# Altium schematic sheet Ethernet.SchDoc
size A4; Author: JCD
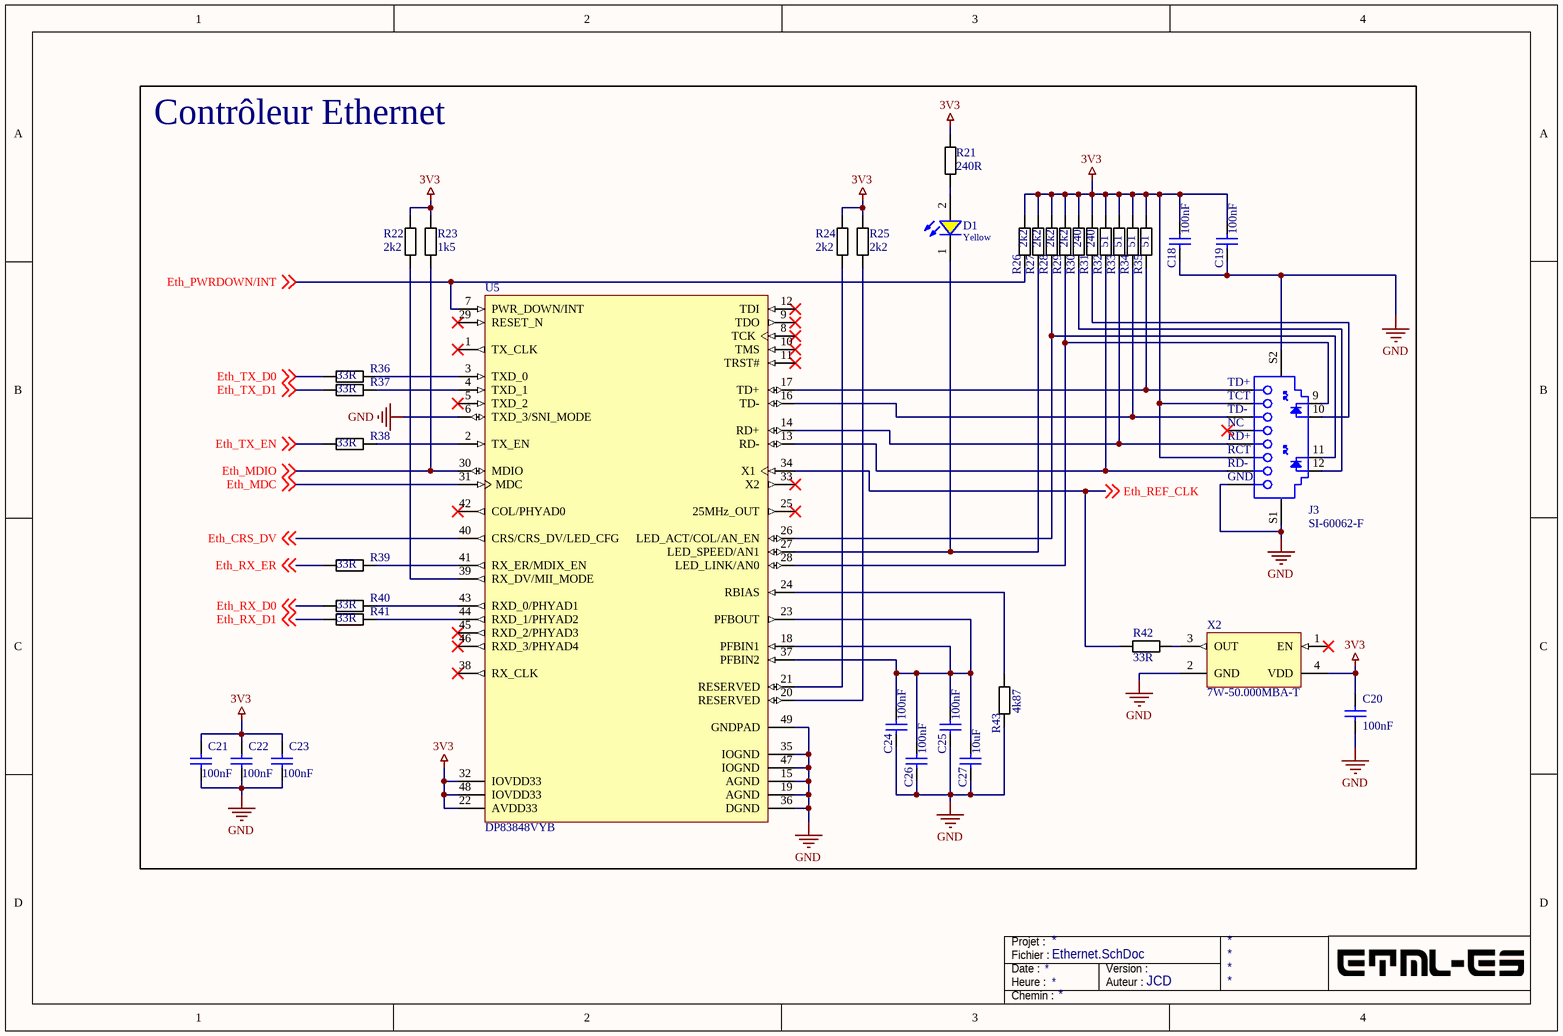
[diagram p0: Ethernet.SchDoc]

## Parts
C18  100nF  [C0805]
C19  100nF  [C0805]
C20  100nF  [C0805]
C21  100nF  [C0805]
C22  100nF  [C0805]
C23  100nF  [C0805]
C24  100nF  [C0805]
C25  100nF  [C0805]
C26  100nF  [C0805]
C27  10uF  [C0805]
D1  Yellow  [WL-SMCW_0805]
J3  SI-60062-F  [BELF-SI-60062-F_V]
R21  240R  [RESC0805(2012)_L]
R22  2k2  [RESC0805(2012)_L]
R23  1k5  [RESC0805(2012)_L]
R24  2k2  [RESC0805(2012)_L]
R25  2k2  [RESC0805(2012)_L]
R26  2k2  [RESC0805(2012)_L]
R27  2k2  [RESC0805(2012)_L]
R28  2k2  [RESC0805(2012)_L]
R29  2k2  [RESC0805(2012)_L]
R30  240  [RESC0805(2012)_L]
R31  240  [RESC0805(2012)_L]
R32  51  [RESC0805(2012)_L]
R33  51  [RESC0805(2012)_L]
R34  51  [RESC0805(2012)_L]
R35  51  [RESC0805(2012)_L]
R36  33R  [RESC0805(2012)_L]
R37  33R  [RESC0805(2012)_L]
R38  33R  [RESC0805(2012)_L]
R39  33R  [RESC0805(2012)_L]
R40  33R  [RESC0805(2012)_L]
R41  33R  [RESC0805(2012)_L]
R42  33R  [RESC0805(2012)_L]
R43  4k87  [RESC0805(2012)_L]
U5  DP83848VYB  [DP83848]
X2  7W-50.000MBA-T  [TXC-L500W700H130-4_V]

## Blocks framed on the sheet
Contrôleur Ethernet: C18-C27 D1 J3 R21-R43 U5 X2

## Nets
3V3: C18.2 C19.2 C20.2 C21.2 C22.2 C23.2 J3.2(TCT) J3.6(RCT) R21.1 R22.1 R23.1 R24.1 R25.1 R26.1 R27.1 R28.1 R29.1 R30.1 R31.1 R32.1 R33.1 R34.1 R35.1 U5.22(AVDD33) U5.32(IOVDD33) U5.48(IOVDD33) X2.4(VDD)
GND: C18.1 C19.1 C20.1 C21.1 C22.1 C23.1 C24.1 C25.1 C26.1 C27.1 J3.8(GND) J3.S1 J3.S2 R43.2 U5.6(TXD_3/SNI_MODE) U5.15(AGND) U5.19(AGND) U5.35(IOGND) U5.36(DGND) U5.47(IOGND) U5.49(GNDPAD) X2.2(GND)
Eth_CRS_DV: U5.40(CRS/CRS_DV/LED_CFG) ; off-sheet Eth_CRS_DV
Eth_MDC: U5.31(MDC) ; off-sheet Eth_MDC
Eth_MDIO: R23.2 U5.30(MDIO) ; off-sheet Eth_MDIO
Eth_PWRDOWN/INT: R26.2 U5.7(PWR_DOWN/INT) ; off-sheet Eth_PWRDOWN/INT
Eth_REF_CLK: R42.1 U5.34(X1) ; off-sheet Eth_REF_CLK
Eth_RX_D0: R40.1 ; off-sheet Eth_RX_D0
Eth_RX_D1: R41.1 ; off-sheet Eth_RX_D1
Eth_RX_ER: R39.1 ; off-sheet Eth_RX_ER
Eth_TX_D0: R36.1 ; off-sheet Eth_TX_D0
Eth_TX_D1: R37.1 ; off-sheet Eth_TX_D1
Eth_TX_EN: R38.1 ; off-sheet Eth_TX_EN
NetC24_2: C24.2 C25.2 C26.2 C27.2 U5.18(PFBIN1) U5.23(PFBOUT) U5.37(PFBIN2)
NetD1_1: D1.1(K) R27.2 U5.27(LED_SPEED/AN1)
NetD1_2: D1.2(A) R21.2
NetJ3_1: J3.1(TD+) R35.2 U5.17(TD+)
NetJ3_3: J3.3(TD-) R34.2 U5.16(TD-)
NetJ3_5: J3.5(RD+) R33.2 U5.14(RD+)
NetJ3_7: J3.7(RD-) R32.2 U5.13(RD-)
NetJ3_9: J3.9 R29.2 U5.28(LED_LINK/AN0)
NetJ3_10: J3.10 R31.2
NetJ3_11: J3.11 R28.2 U5.26(LED_ACT/COL/AN_EN)
NetJ3_12: J3.12 R30.2
NetR22_2: R22.2 U5.39(RX_DV/MII_MODE)
NetR24_2: R24.2 U5.21(RESERVED)
NetR25_2: R25.2 U5.20(RESERVED)
NetR36_2: R36.2 U5.3(TXD_0)
NetR37_2: R37.2 U5.4(TXD_1)
NetR38_2: R38.2 U5.2(TX_EN)
NetR39_2: R39.2 U5.41(RX_ER/MDIX_EN)
NetR40_2: R40.2 U5.43(RXD_0/PHYAD1)
NetR41_2: R41.2 U5.44(RXD_1/PHYAD2)
NetR42_2: R42.2 X2.3(OUT)
NetR43_1: R43.1 U5.24(RBIAS)

Not connected (* = marked no-connect by the designer): J3 4(NC)*; U5 1(TX_CLK)* 5(TXD_2)* 8(TCK)* 9(TDO)* 10(TMS)* 11(TRST#)* 12(TDI)* 25(25MHz_OUT)* 29(RESET_N)* 33(X2)* 38(RX_CLK)* 42(COL/PHYAD0)* 45(RXD_2/PHYAD3)* 46(RXD_3/PHYAD4)*; X2 1(EN)*

## Notes on the sheet
- Fichier :
- Date :
- Heure :
- Projet :
- Auteur :
- Version :
- Chemin :

## Library data of the parts
C18-C27 = Cap: Capacitor; Published: 8-Jun-2000; LatestRevisionDate: 17-Jul-2002; LatestRevisionNote: Re-released for DXP Platform.; PackageReference: RAD-0.3; Publisher: Altium Limited; PackageDescription: Radial Cap, Thru-Hole; 2 Leads; 0.3 in Pin Spacing
  C18-C26: Value: 100nF
  C27: Value: 10uF
D1 = 150080YS75000: SMT Mono-color Chip LED Waterclear WL-SMCW, size 0805, Yellow, 2 V, 140 deg, 120 mcd; Forward Voltage: 2 V; Viewing Angle: 140 deg; Peak Wavelength: 595 nm; Dominant Wavelength: 590 nm; Luminous Intensity: 120 mcd; Chip Technology: AlInGaP; ComponentLink1Description: Manufacturer; ComponentLink1URL: http://www.we-online.de; ComponentLink2Description: Datasheet; ComponentLink2URL: https://katalog.we-online.de/led/datasheet/150080YS75000.pdf; Part Number: 150080YS75000; Published Date: November 2018; Publisher: Wurth Elektronik; Size: 0805; Operating Temperature: -40 to 85 degC; Emitting Color: Yellow; Mounting Technology: SMT; Packaging: Tape and Reel
J3 = CMP-2000-07059-1: 1 Port RJ45 Magjack Connector with Yellow and Green LED, 10/100 Base-T, 12-Pin THD, RoHS, Tray; Manufacturer: Bel Fuse; Number of Ways: 8P4C; Gender: Female; Shield Type: STP; Connector Type: RJ45; Contact Plating: Gold; Mounting Type: ThroughHole; Datasheet Version: Rev. B0, 09/2008; Package Reference: SI-60062-F; Manufacturer URL: http://belfuse.com/; Package Description: 12-Pin Through Hole Device, Body 21.59 x 16.13 mm; Series: MagJack; Contact Material: CopperAlloy; Datasheet URL: http://belfuse.com/pdfs/SI-60062-F.pdf; Width: 17.98mm; Length: 15.21mm; Mounting Technology: ThroughHole; Depth: 21.59mm; Orientation: Straight
R21-R43 = Resistance
U5 = IN-LNTX-DP83848VYB
X2 = CMP-0269-00001-1: OSC, 50.000 MHZ, ± 25 ppm, 3.3 V, SMT; Rise/Fall Time: 7 ns; Body Shape: Rectangular, 4 SMD; Frequency Stability: Â± 25 ppm(-10 to +70 degC); ComponentLink2Description: Datasheet; PartNumber: 7W-50.000MBA-T; Mounting Technology: Surface Mount; Storage Temperature: -50 to 125 degC; PackageReference: L500W700H130-4; ComponentLink1URL: http://www.txccrystal.com/; ComponentLink2URL: http://www.txccrystal.com/images/pdf/7w-tight.pdf; ComponentLink1Description: Manufacturer URL; PackageDescription: 4-Pin SMT LED, 7 x 5 mm Body; Operating Temperature Range: -40 to 85 degC